# EAGLE design PPSB-T (EAGLE 9.6.1)
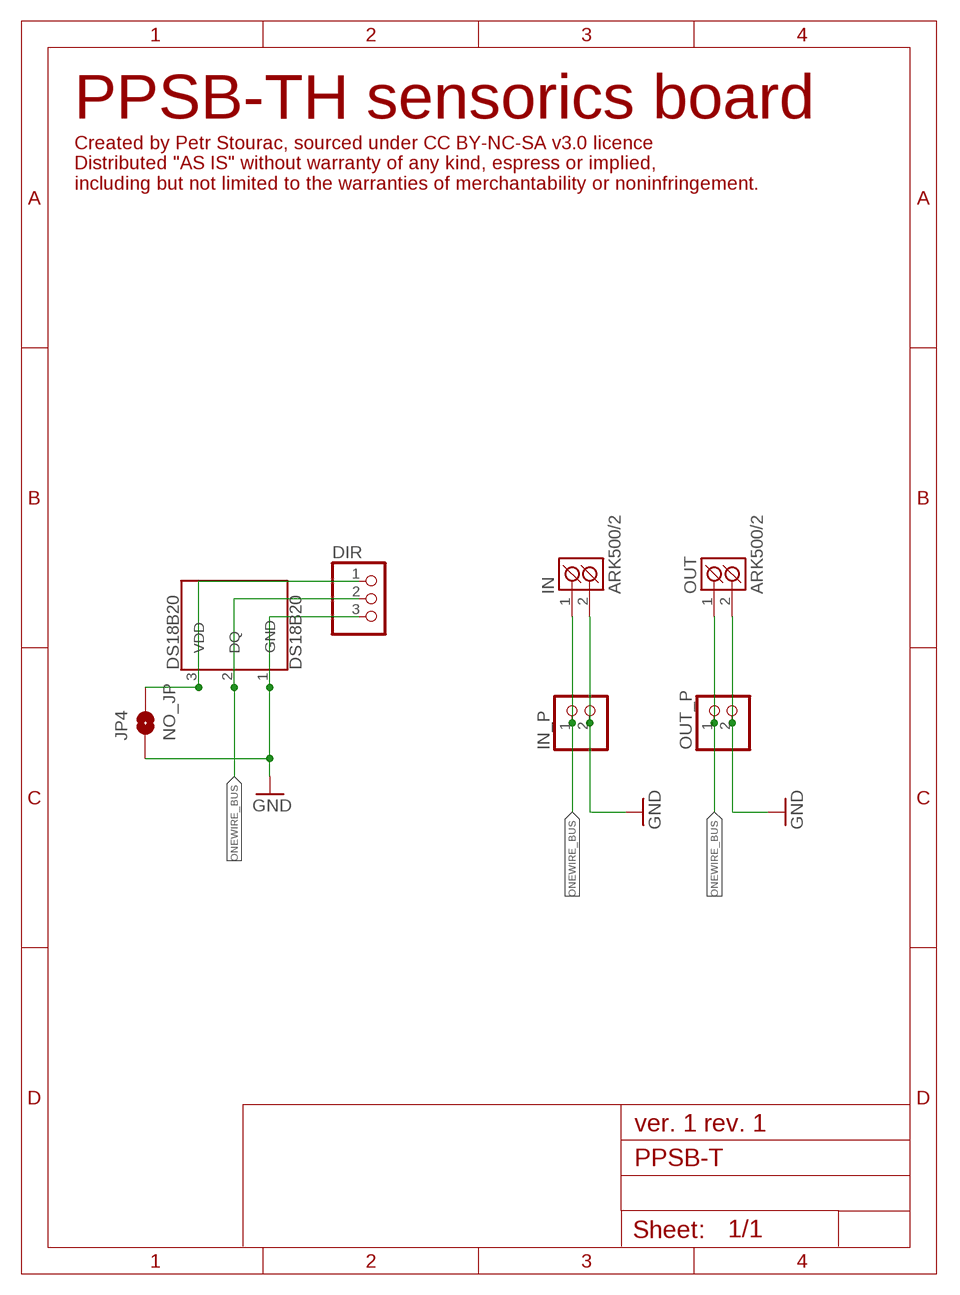
[diagram p0: schematic, sheet 1]

## Parts
DIR  PINHD-1X3  [1X03]
DS18B20  DS18B20  [TO-92-AMMO]
IN  ARK500/2  [ARK500/2]
IN_P  PINHD-1X2  [1X02]
JP4  NO_JP  JUMPER-SMT_2_NO_NO-SILK  [SMT-JUMPER_2_NO_NO-SILK]
OUT  ARK500/2  [ARK500/2]
OUT_P  PINHD-1X2  [1X02]

## Nets
GND: DIR.3 DS18B20.1(GND) IN.2(K2) IN_P.2 JP4.1 OUT.2(K2) OUT_P.2
N$1: DIR.1 DS18B20.3(VDD) JP4.2
ONEWIRE_BUS: DIR.2 DS18B20.2(DQ) IN.1(K1) IN_P.1 OUT.1(K1) OUT_P.1

## Notes on the sheet
- PPSB-TH sensorics board
- Created by Petr Stourac, sourced under CC BY-NC-SA v3.0 licence
  Distributed "AS IS" without warranty of any kind, espress or implied, 
  including but not limited to the warranties of merchantability or noninfringement.
- ver. 1 rev. 1

## Library data of the parts
DIR = pinhead:PINHD-1X3: PIN HEADER
DS18B20 = SparkFun-Sensors:DS18B20: Dallas/Maxim DS18B20 1-Wire Temperature Sensor The DS18B20 reports degrees C with 9 to 12-bit precision, -55C to 125C (+/-0.5C). Each sensor has a unique 64-Bit Serial number etched into it - allows for a huge number of sensors to be used on one data bus. Datasheet <http://datasheets.maximintegrated.com/en/ds/DS18B20.pdf> SparkFun Products One Wire Digital Temperature Sensor - DS18B20 <https://www.sparkfun.com/products/245> (SEN-00245); STORE_ID: SEN-00245
IN OUT = #PaJa_konektory:ARK500/2: Svorkovnice - roztec 5mm - dvojita
IN_P OUT_P = pinhead:PINHD-1X2: PIN HEADER
JP4 = SparkFun-Jumpers:JUMPER-SMT_2_NO: Normally open jumper This jumper has two pads in close proximity to each other. Apply solder to close the connection. Round pads are easier to solder for beginners, but are a lot larger. SparkFun Product that uses the round pads: SparkFun EL Sequencer <https://www.sparkfun.com/products/12781>

## Board
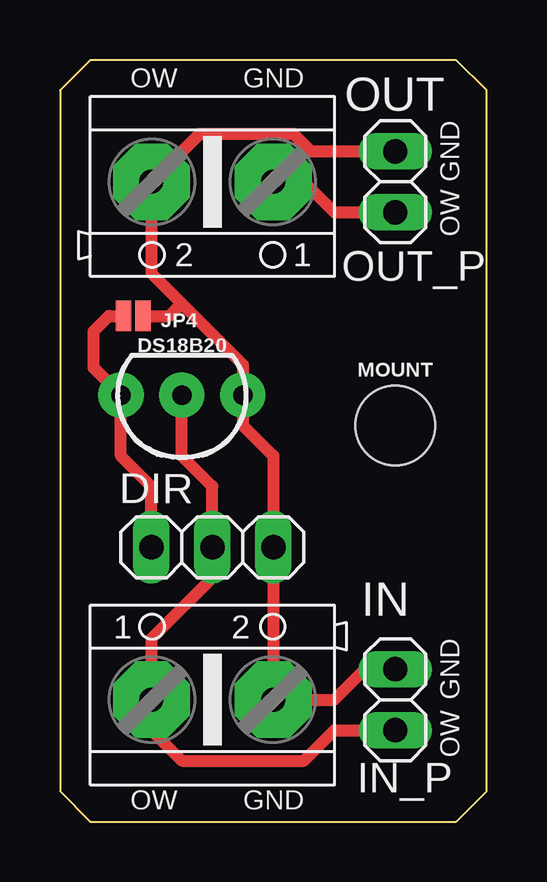
[diagram p1: board, top side]
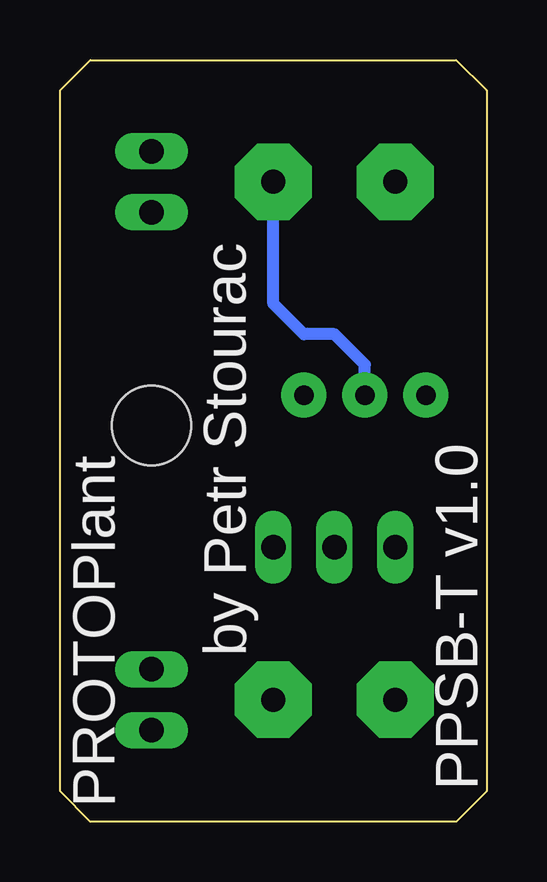
[diagram p2: board, bottom side, seen from below]

Size 17.78 x 31.75 mm. Coordinates in mm from the lower left corner, seen from the top.
Outline: 0,1.27 1.27,0 16.51,0 17.78,1.27 17.78,30.48 16.51,31.75 1.27,31.75 0,30.48 0,1.27
Copper layers (1*16): Top 0.035mm / dielectric 1.5mm / Bottom 0.035mm
Design rules "default": minimum track width 6mil, minimum drill 0.35mm, track to track 6mil, track to pad 6mil, pad to pad 6mil, via to via 6mil, smd to smd 6mil, copper to edge 40mil, drill to drill 6mil, minimum pad ring 10mil, minimum via ring 8mil, stop-mask expansion 4mil, vias tented up to drill 0mil, thermal gap 10mil

### Footprints (pad centres in the part's own frame; a part is rotated, then mirrored left to right if it is on the bottom)
1X03 = drill 1.016 long: 1 -2.54,0; 2 0,0; 3 2.54,0
TO-92-AMMO = drill 0.813 pad 1.88: 1 -2.54,0; 2 0,0; 3 2.54,0
ARK500/2 = drill 1 pad 3.2 octagon: 1 -2.54,0; 2 2.54,0
1X02 = drill 1.016 long: 1 -1.27,0; 2 1.27,0
SMT-JUMPER_2_NO_NO-SILK = smd 0.635 x 1.27: 1 -0.406,0; 2 0.406,0
STAND-OFF = hole 3.302: 0,0

### Placement (x,y rotation side)
DIR  6.35,11.43 0 top
DS18B20  5.08,17.78 180 top
IN  6.35,5.08 0 top
IN_P  13.97,5.08 90 top
JP4  3.05,21.08 180 top
MOUNT  [STAND-OFF]  13.97,16.51 0 top
OUT  6.35,26.67 180 top
OUT_P  13.97,26.67 90 top

### Tracks (layer width: path | path; a pad name or v marks a point on that pad's centre or on a via)
GND
  Top 0.508: 5.08,21.59 3.81,22.86 OUT.2 5.82,28.68 9.72,28.68 10.46,27.94 OUT_P.2 | 5.08,21.59 7.62,19.05 DS18B20.1 7.62,16.51 8.89,15.24 DIR.3 IN.2 11.43,5.08 12.7,6.35 IN_P.2 | JP4.1 4.57,21.08 5.08,21.59
N$1
  Top 0.508: DIR.1 3.81,13.97 2.54,15.24 DS18B20.3 1.4,18.92 1.4,20.45 2.03,21.08 JP4.2
ONEWIRE_BUS
  Top 0.508: DS18B20.2 5.08,15.24 6.35,13.97 DIR.2 6.35,10.16 3.81,7.62 IN.1 3.81,3.81 5.08,2.54 10.16,2.54 11.43,3.81 IN_P.1 | OUT.1 10.16,26.67 11.43,25.4 OUT_P.1
  Bottom 0.508: DS18B20.2 5.08,19.05 6.35,20.32 7.62,20.32 8.89,21.59 OUT.1

### Text on the board
tNames: OW | GND | GND | OW | GND | OW | OW | GND
bNames: by Petr Stourac | PPSB-T v1.0 | PROTOPlant